# Altium schematic sheet RTM_4SFP_3QSFP_TOP.SchDoc: RTM 4SFP 3QSFP
size 420 x 297 mm; Author: G.K.; CompanyName: WUT; DrawnBy: G.K.; Organization: CERN; Address1: Warsaw Univeristy of Technology; Address2: Nowowiejska 15/19; DocumentNumber: 1; Revision: -; SheetNumber: 1; SheetTotal: -; EDA_Number: ARTIQ; Projet: RTM 4SFP 3QSFP; ModifiedBy: -; CreateDate: XX/XX/XXXX; CheckedDate: -; Title2: TOP; DivGrp: ISE; Designer: G.K.; ModifiedDate: -; ProjectName: RTM 4SFP 3QSFP
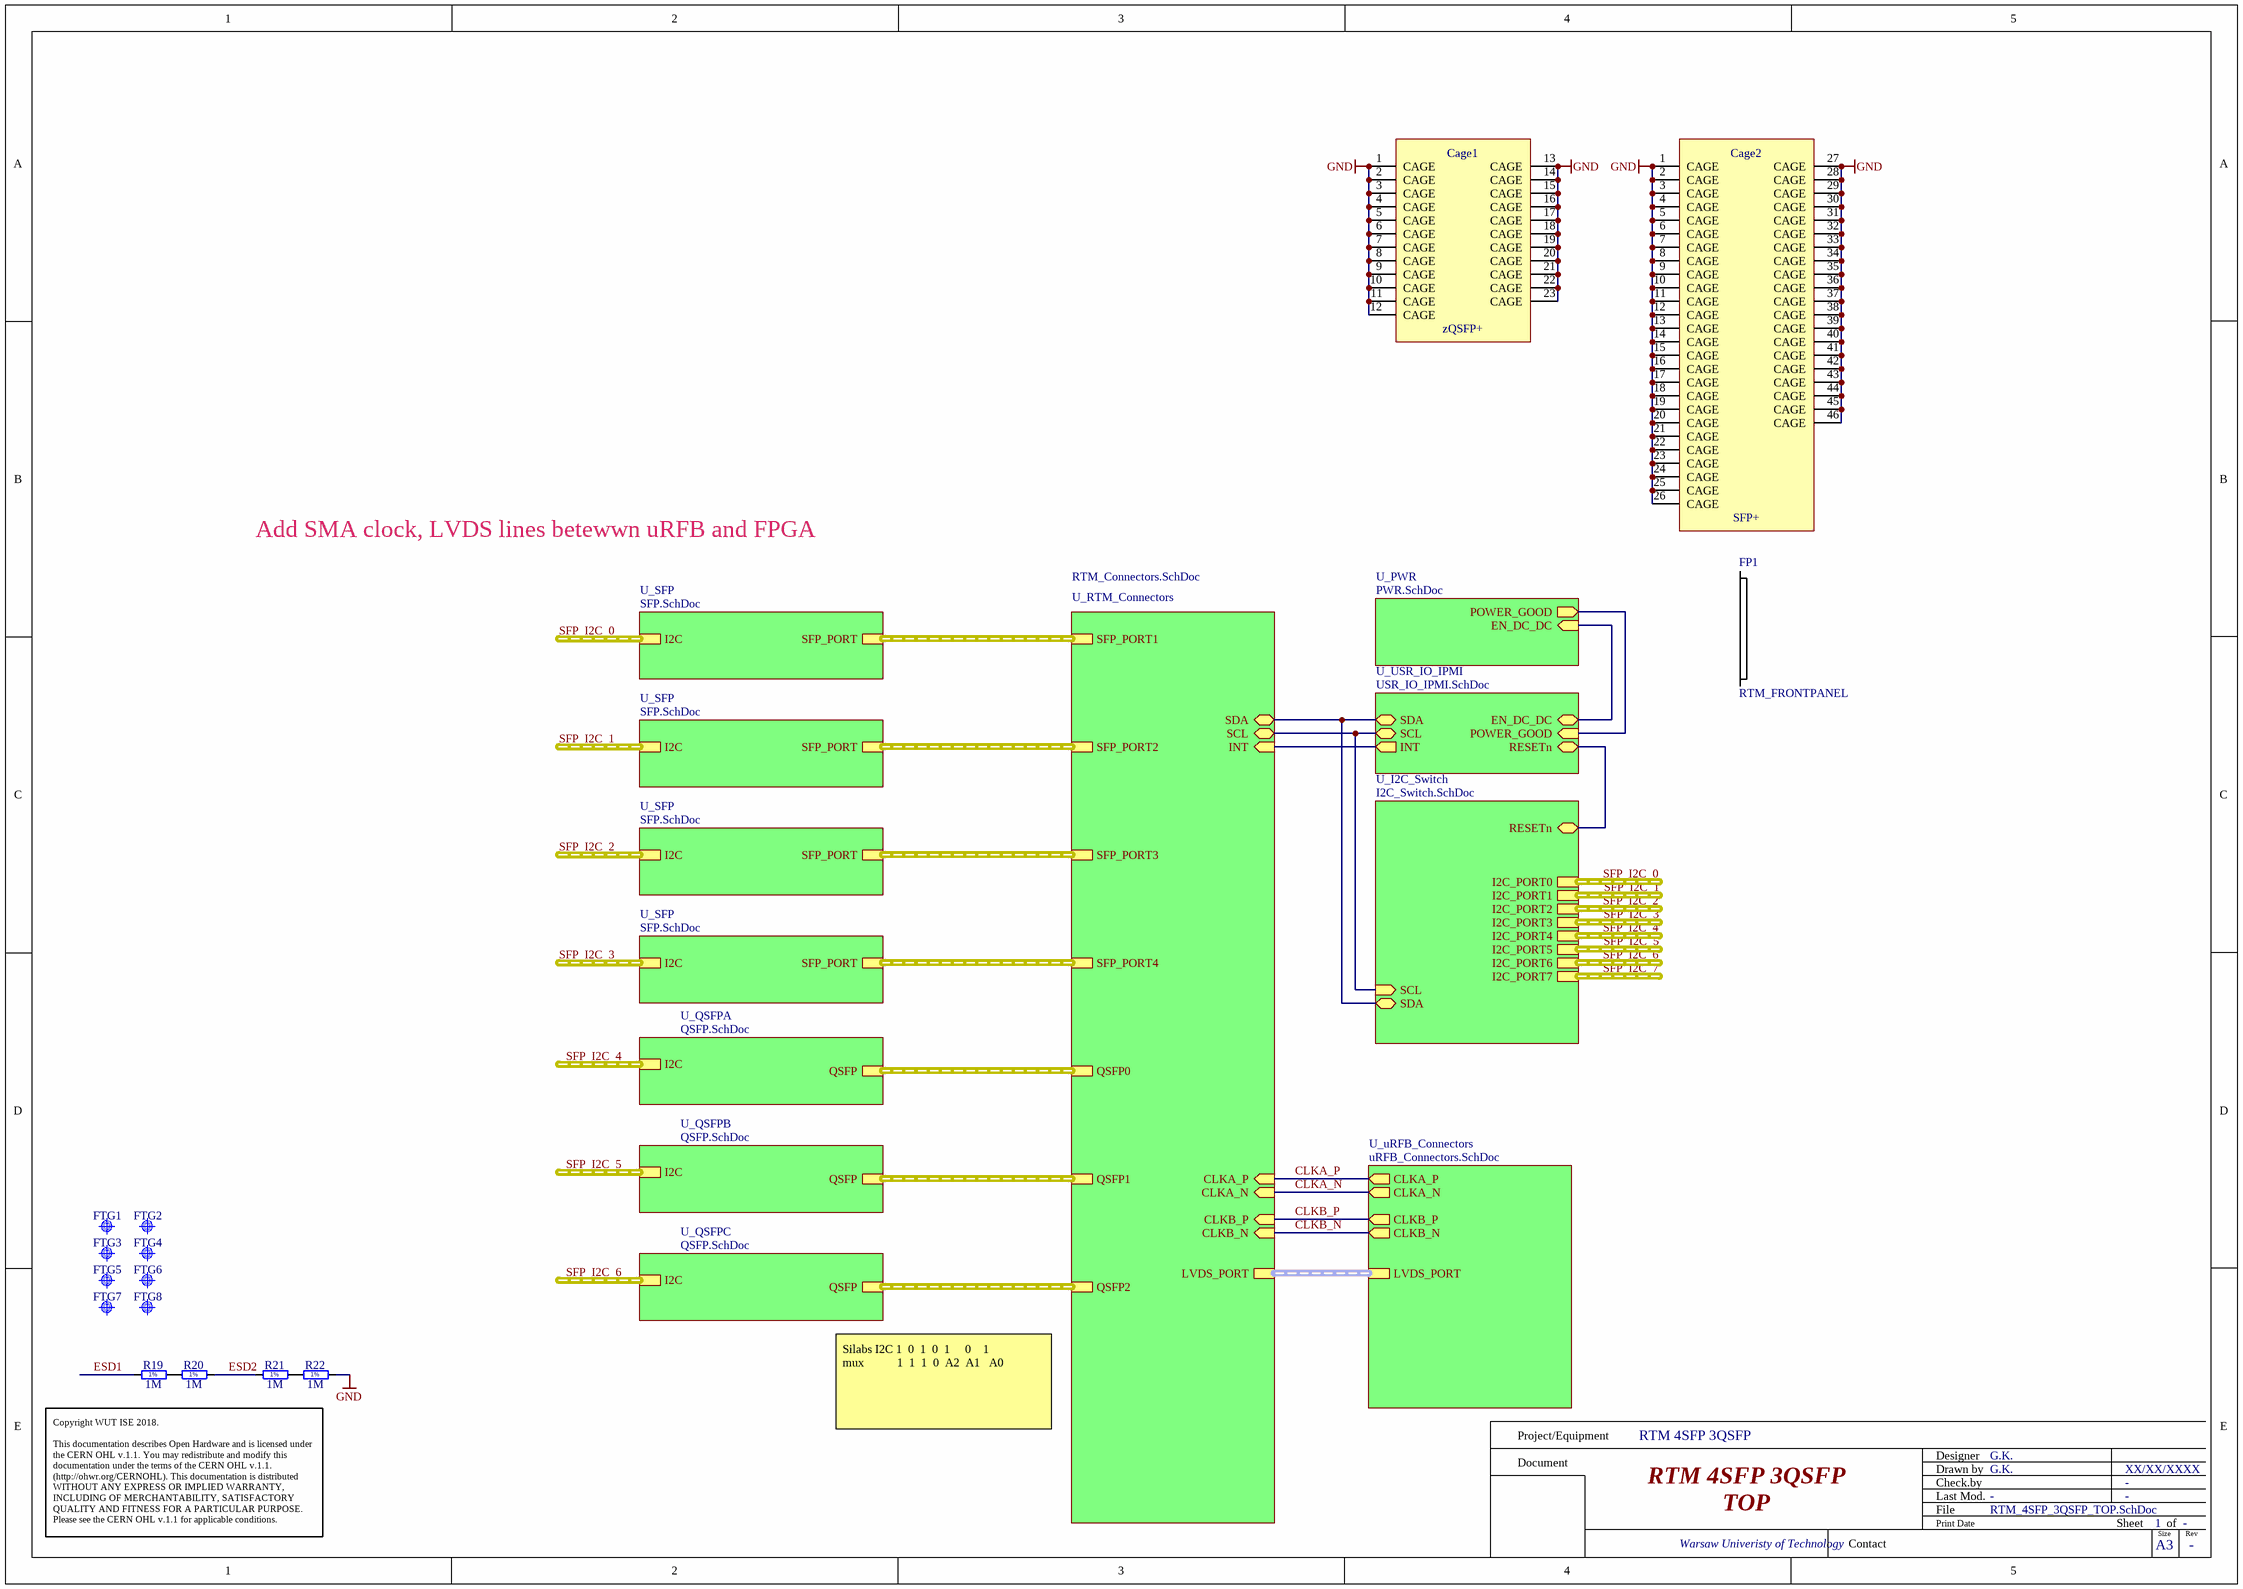
[diagram p0: RTM_4SFP_3QSFP_TOP.SchDoc]

## Parts
Cage1  zQSFP+  [TYCO_2170737-1]
Cage2  SFP+  [TYCO_2007132-1]
FP1  RTM_FRONTPANEL  [RTM_FRONTPANEL]
FTG1  Use only in PCB  [FIDUCIAL_TOP_S100-200]  (value not drawn)
FTG2  Use only in PCB  [FIDUCIAL_TOP_S100-200]  (value not drawn)
FTG3  Use only in PCB  [FIDUCIAL_TOP_S100-200]  (value not drawn)
FTG4  Use only in PCB  [FIDUCIAL_TOP_S100-200]  (value not drawn)
FTG5  Use only in PCB  [FIDUCIAL_TOP_S100-200]  (value not drawn)
FTG6  Use only in PCB  [FIDUCIAL_TOP_S100-200]  (value not drawn)
FTG7  Use only in PCB  [FIDUCIAL_TOP_S100-200]  (value not drawn)
FTG8  Use only in PCB  [FIDUCIAL_TOP_S100-200]  (value not drawn)
R19  1M  [RESC3216X65N]
R20  1M  [RESC3216X65N]
R21  1M  [RESC3216X65N]
R22  1M  [RESC3216X65N]

## Sub-sheets
U_I2C_Switch = I2C_Switch.SchDoc: I2C_PORT5 (harness I2C), I2C_PORT2 (harness I2C), I2C_PORT1 (harness I2C), I2C_PORT4 (harness I2C), I2C_PORT3 (harness I2C), I2C_PORT7 (harness I2C), I2C_PORT6 (harness I2C), I2C_PORT0 (harness I2C), SDA (bidir), SCL (in), RESETn (bidir)
U_PWR = PWR.SchDoc: POWER_GOOD (out), EN_DC_DC (in)
U_QSFPA = QSFP.SchDoc: QSFP (harness FP), I2C (harness I2C)
U_QSFPB = QSFP.SchDoc: QSFP (harness FP), I2C (harness I2C)
U_QSFPC = QSFP.SchDoc: QSFP (harness FP), I2C (harness I2C)
U_RTM_Connectors = RTM_Connectors.SchDoc: SFP_PORT4 (harness SFP_PORT), SFP_PORT3 (harness SFP_PORT), SFP_PORT2 (harness SFP_PORT), SFP_PORT1 (harness SFP_PORT), SDA (bidir), SCL (bidir), INT (in), QSFP0 (harness FP), QSFP1 (harness FP), QSFP2 (harness FP), CLKA_P (in), CLKA_N (in), CLKB_P (in), CLKB_N (in), LVDS_PORT (harness LVDS_PORT)
U_SFP = SFP.SchDoc: I2C (harness I2C), SFP_PORT (harness SFP_PORT)
U_SFP = SFP.SchDoc: SFP_PORT (harness SFP_PORT), I2C (harness I2C)
U_SFP = SFP.SchDoc: SFP_PORT (harness SFP_PORT), I2C (harness I2C)
U_SFP = SFP.SchDoc: SFP_PORT (harness SFP_PORT), I2C (harness I2C)
U_uRFB_Connectors = uRFB_Connectors.SchDoc: CLKB_P (out), CLKA_N (out), CLKA_P (out), CLKB_N (out), LVDS_PORT (harness LVDS_PORT)
U_USR_IO_IPMI = USR_IO_IPMI.SchDoc: SDA (bidir), SCL (bidir), INT (out), EN_DC_DC (bidir), POWER_GOOD (in), RESETn (bidir)

## Nets
GND: Cage1.1(CAGE) Cage1.2(CAGE) Cage1.3(CAGE) Cage1.4(CAGE) Cage1.5(CAGE) Cage1.6(CAGE) Cage1.7(CAGE) Cage1.8(CAGE) Cage1.9(CAGE) Cage1.10(CAGE) Cage1.11(CAGE) Cage1.12(CAGE) Cage1.13(CAGE) Cage1.14(CAGE) Cage1.15(CAGE) Cage1.16(CAGE) Cage1.17(CAGE) Cage1.18(CAGE) Cage1.19(CAGE) Cage1.20(CAGE) Cage1.21(CAGE) Cage1.22(CAGE) Cage1.23(CAGE) Cage2.1(CAGE) Cage2.2(CAGE) Cage2.3(CAGE) Cage2.4(CAGE) Cage2.5(CAGE) Cage2.6(CAGE) Cage2.7(CAGE) Cage2.8(CAGE) Cage2.9(CAGE) Cage2.10(CAGE) Cage2.11(CAGE) Cage2.12(CAGE) Cage2.13(CAGE) Cage2.14(CAGE) Cage2.15(CAGE) Cage2.16(CAGE) Cage2.17(CAGE) Cage2.18(CAGE) Cage2.19(CAGE) Cage2.20(CAGE) Cage2.21(CAGE) Cage2.22(CAGE) Cage2.23(CAGE) Cage2.24(CAGE) Cage2.25(CAGE) Cage2.26(CAGE) Cage2.27(CAGE) Cage2.28(CAGE) Cage2.29(CAGE) Cage2.30(CAGE) Cage2.31(CAGE) Cage2.32(CAGE) Cage2.33(CAGE) Cage2.34(CAGE) Cage2.35(CAGE) Cage2.36(CAGE) Cage2.37(CAGE) Cage2.38(CAGE) Cage2.39(CAGE) Cage2.40(CAGE) Cage2.41(CAGE) Cage2.42(CAGE) Cage2.43(CAGE) Cage2.44(CAGE) Cage2.45(CAGE) Cage2.46(CAGE) R22.2
CLKA_N: sheet U_RTM_Connectors/CLKA_N, sheet U_uRFB_Connectors/CLKA_N
CLKA_P: sheet U_RTM_Connectors/CLKA_P, sheet U_uRFB_Connectors/CLKA_P
CLKB_N: sheet U_RTM_Connectors/CLKB_N, sheet U_uRFB_Connectors/CLKB_N
CLKB_P: sheet U_RTM_Connectors/CLKB_P, sheet U_uRFB_Connectors/CLKB_P
ESD1: R19.1
ESD2: R20.2 R21.1
NetR19_2: R19.2 R20.1
NetR21_2: R21.2 R22.1
(unnamed): sheet U_I2C_Switch/SDA, sheet U_RTM_Connectors/SDA, sheet U_USR_IO_IPMI/SDA
(unnamed): sheet U_I2C_Switch/SCL, sheet U_RTM_Connectors/SCL, sheet U_USR_IO_IPMI/SCL
(unnamed): sheet U_I2C_Switch/RESETn, sheet U_USR_IO_IPMI/RESETn
(unnamed): sheet U_RTM_Connectors/INT, sheet U_USR_IO_IPMI/INT
(unnamed): sheet U_USR_IO_IPMI/EN_DC_DC, sheet U_PWR/EN_DC_DC
(unnamed): sheet U_USR_IO_IPMI/POWER_GOOD, sheet U_PWR/POWER_GOOD

## Buses and harness runs
harness SFP_I2C_0 = sheet U_I2C_Switch/I2C_PORT0
harness SFP_I2C_0 = sheet U_SFP/I2C
harness SFP_I2C_1 = sheet U_I2C_Switch/I2C_PORT1
harness SFP_I2C_1 = sheet U_SFP/I2C
harness SFP_I2C_2 = sheet U_I2C_Switch/I2C_PORT2
harness SFP_I2C_2 = sheet U_SFP/I2C
harness SFP_I2C_3 = sheet U_I2C_Switch/I2C_PORT3
harness SFP_I2C_3 = sheet U_SFP/I2C
harness SFP_I2C_4 = sheet U_I2C_Switch/I2C_PORT4
harness SFP_I2C_4 = sheet U_QSFPA/I2C
harness SFP_I2C_5 = sheet U_I2C_Switch/I2C_PORT5
harness SFP_I2C_5 = sheet U_QSFPB/I2C
harness SFP_I2C_6 = sheet U_I2C_Switch/I2C_PORT6
harness SFP_I2C_6 = sheet U_QSFPC/I2C
harness SFP_I2C_7 = sheet U_I2C_Switch/I2C_PORT7
harness sheet U_QSFPA/QSFP = sheet U_RTM_Connectors/QSFP0
harness sheet U_QSFPB/QSFP = sheet U_RTM_Connectors/QSFP1
harness sheet U_QSFPC/QSFP = sheet U_RTM_Connectors/QSFP2
harness sheet U_RTM_Connectors/LVDS_PORT = sheet U_uRFB_Connectors/LVDS_PORT
harness sheet U_RTM_Connectors/SFP_PORT1 = sheet U_SFP/SFP_PORT
harness sheet U_RTM_Connectors/SFP_PORT2 = sheet U_SFP/SFP_PORT
harness sheet U_RTM_Connectors/SFP_PORT3 = sheet U_SFP/SFP_PORT
harness sheet U_RTM_Connectors/SFP_PORT4 = sheet U_SFP/SFP_PORT

## Notes on the sheet
- Add SMA clock, LVDS lines betewwn uRFB and FPGA
- Silabs I2C 1  0  1  0  1     0    1
  mux           1  1  1  0  A2  A1   A0
- Project/Equipment
- Document
- Designer
- Drawn by
- Check.by
- Copyright WUT ISE 2018.
  This documentation describes Open Hardware and is licensed under the CERN OHL v.1.1. You may redistribute and modify this documentation under the terms of the CERN OHL v.1.1. (http://ohwr.org/CERNOHL). This documentation is distributed WITHOUT ANY EXPRESS OR IMPLIED WARRANTY, INCLUDING OF MERCHANTABILITY, SATISFACTORY QUALITY AND FITNESS FOR A PARTICULAR PURPOSE. Please see the CERN OHL v.1.1 for applicable conditions.
- Contact
- File
- Last Mod.
- Print Date
- Sheet
- Size
- A3
- of
- Rev
- (in symbol R1206_1M_1%_0.25W_100PPM) 1%

## Library data of the parts
Cage1 = TYCO_2170737-1: QSFP+ 1x3 Cage (23Pins); Part Description: 1x3 Press Fit zQSFP+/QSFP28 Cage (Quad Small Form-factor Pluggable), Internal/External EMI Springs; Manufacturer: TYCO ELECTRONICS; Part Number: TYCO_2170737-1; Component Kind: Standard; Component Type: Standard; Pin Count: 23; Family: zQSFP+; Mounted: Yes; Socket: No; SMD: No; PressFit: Yes; Sense: No; Status: None; Manufacturer Part Number: 2170737-1; ComponentHeight: 9.65mm; HelpURL: \\cern.ch\dfs\Applications\Altium\Datasheets\TYCO_2170737-1.pdf; Author: CERN DEM JLC; CreateDate: 29.05.2018; LatestRevisionDate: 29.05.2018
Cage2 = TYCO_2007132-1: SFP+  1x4 Cage (46 Pins); Part Description: 1x4 Press Fit Cage For Use with SFP+ Connector (Small Form-factor Pluggable); Manufacturer: TYCO ELECTRONICS; Table: TYCO; Part Number: TYCO_2007132-1; Component Kind: Standard; Component Type: Standard; Pin Count: 46; Family: SFP+; Mounted: Yes; Socket: No; SMD: No; Status: None; Manufacturer Part Number: 2007132-1; ComponentHeight: 9.7mm; HelpURL: \\cern.ch\dfs\Applications\Altium\Datasheets\TYCO_2007132-1.pdf; Author: CERN DEM JLC; CreateDate: 2013-06-04; LatestRevisionDate: 2013-06-12
FP1 = RTM_FRONTPANEL: RTM Frontpanel; Value: RTM_FRONTPANEL
FTG1 FTG3 FTG5 FTG7 = FIDUCIAL_TARGET_S100-200: Fiducial Target; Part Description: Square Fiducial Target, Top Layer, 1.0mm, Top Solder 2.0mm, Keepout =2.0mm; Mounted: No; Table: Pads; Part Number: FIDUCIAL_TARGET_S100-200; Component Kind: Standard (No BOM); Component Type: Standard (No BOM); Pin Count: 1; Family: Fiducial; Socket: No; SMD: Yes; Status: None; ComponentHeight: 0mm; Author: CERN DEM JLC; CreateDate: 2010-02-09; LatestRevisionDate: 2012-04-04; PackageDescription: Square Fiducial Target, Top Layer, 1.0mm, Top Solder 2.0mm, Keepout =2.0mm
FTG2 FTG4 FTG6 FTG8 = FIDUCIAL_TARGET_S100-200: Fiducial Target; Part Description: Square Fiducial Target, Top Layer, 1.0mm, Top Solder 2.0mm, Keepout =2.0mm; Mounted: No; Part Number: FIDUCIAL_TARGET_S100-200; Component Kind: Standard (No BOM); Component Type: Standard (No BOM); Pin Count: 1; Family: Fiducial; Socket: No; SMD: Yes; Status: None; ComponentHeight: 0mm; Author: CERN DEM JLC; CreateDate: 09.02.2010; LatestRevisionDate: 04.04.2012; PackageDescription: Square Fiducial Target, Top Layer, 1.0mm, Top Solder 2.0mm, Keepout =2.0mm; Sense: No; HelpURL: Undefined
R19-R22 = R1206_1M_1%_0.25W_100PPM: Resistor - 1%; Part Description: General Purpose Thick Film Chip Resistor; Manufacturer: GENERIC; Manufacturer1 Part Number: NRC12F1004TRF; Power: 0.25W; TC: ±100ppm/°C; Table: Resistors SMD; Part Number: R1206_1M_1%_0.25W_100PPM; Component Kind: Standard; Component Type: Standard; Pin Count: 2; Value: 1M; Status: Preferred; Tolerance: ±1%; Manufacturer Part Number: R1206_1M_1%_0.25W_100PPM; Case: 1206; Mounted: Yes; Socket: No; SMD: Yes; Manufacturer1 Example: NIC COMPONENT; Manufacturer1 ComponentHeight: 0.65mm; HelpURL: \\cern.ch\dfs\Applications\Altium\Datasheets\R1206_NIC_NRC.pdf; Author: CERN DEM JLC; CreateDate: 2007-12-03; LatestRevisionDate: 2008-03-13